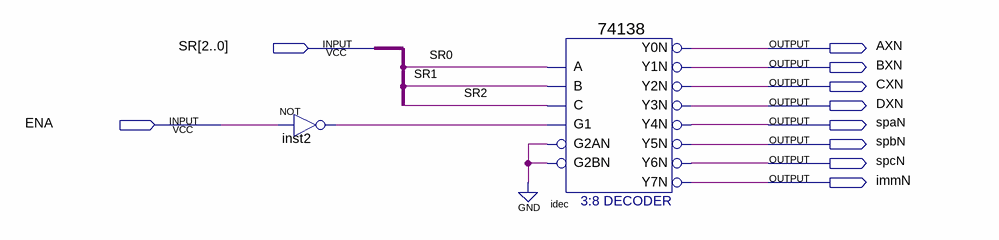
[diagram p0: schematic sheet]
// Quartus schematic COM-to-REAL.bdf as structural Verilog: 2 symbols, 10 pins
module \COM-to-REAL  (
  input  [2:0] SR,
  input  ENA,
  output AXN,
  output BXN,
  output CXN,
  output DXN,
  output spaN,
  output spbN,
  output spcN,
  output immN
);

  wire inst2_out;

  not inst2 (inst2_out, ENA);
  \74138  idec (
    .A(SR[0]), .B(SR[1]), .G1(inst2_out), .C(SR[2]), .G2AN(1'b0), .G2BN(1'b0), .Y0N(AXN), .Y1N(BXN),
    .Y2N(CXN), .Y3N(DXN), .Y4N(spaN), .Y5N(spbN), .Y6N(spcN), .Y7N(immN));
endmodule
